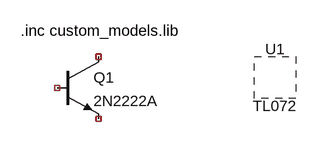
[diagram p0: schematic checking_models.asc]
checking_models.asc, the LTspice schematic file:
Version 4
SHEET 1 880 680
SYMBOL npn 160 112 R0
SYMATTR InstName Q1
SYMATTR Value 2N2222A
SYMBOL OpAmps\\TL072 496 144 R0
SYMATTR InstName U1
TEXT 104 72 Left 2 !.inc custom_models.lib

The netlist it stands for:
* checking_models.asc
Q1 NC_01 NC_02 NC_03 0 2N2222A
* U1: TL072 (symbol OpAmps\TL072 not available, pin order unknown); nets seen at it: 
.model NPN NPN
.model PNP PNP
.lib standard.bjt
.inc custom_models.lib
.backanno
.end